# Altium schematic sheet DT_AZP1524A1_SCH1[SHEET1]_00A.SchDoc
size A3; CheckedBy: XXX; Author: DO NOT USE THIS PARAMETER; CompanyName: Azoteq (Pty) Ltd; Engineer: DO NOT USE THIS PARAMETER; SheetNumber: 1; SheetTotal: 2; Sheet_Title: Sheet 1
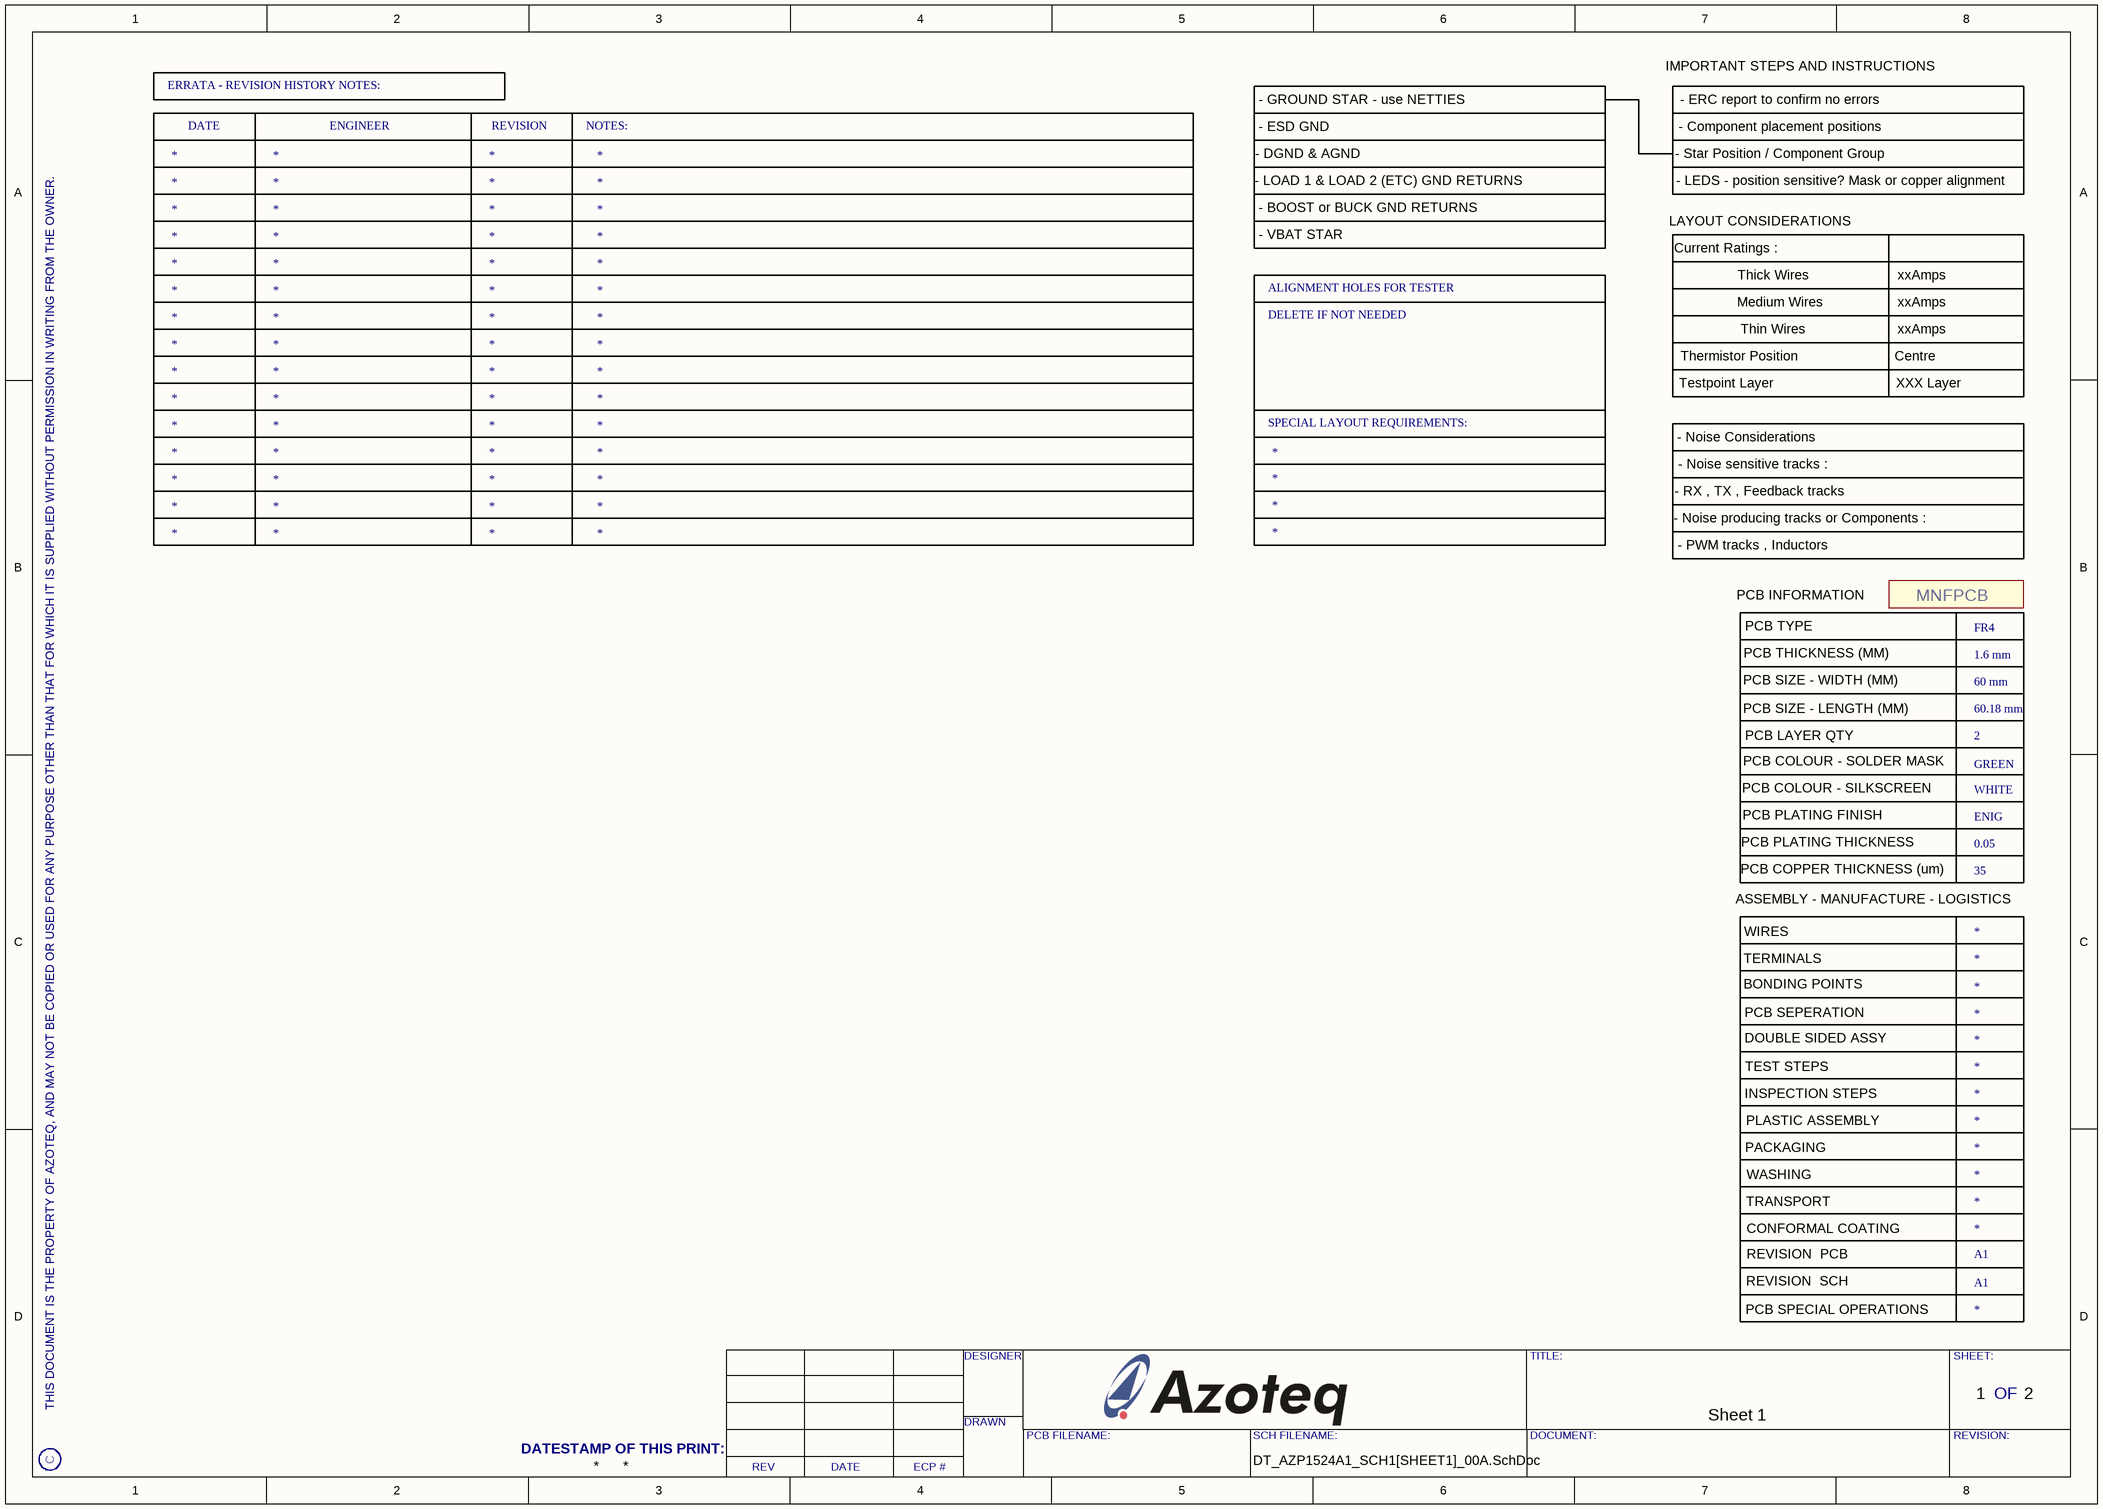
[diagram p0: DT_AZP1524A1_SCH1[SHEET1]_00A.SchDoc]

## Parts
PCB1  PCB TYPE: FR4  PCB THICKNESS: 1.6 mm  PCB LENGTH: 60.18 mm  PCB WIDTH: 60 mm  PCB COLOUR  : MASK: GREEN  PCB PLATING FINISH: ENIG  PCB LAYER QTY: 2  PCB COLOUR : SILK: WHITE  REVISION PCB: A1  Int_Part_Number: MNFPCB  PCB PLATING THICKNESS: 0.05

## Notes on the sheet
- ERRATA - REVISION HISTORY NOTES:
- - GROUND STAR - use NETTIES
- - ERC report to confirm no errors
- IMPORTANT STEPS AND INSTRUCTIONS
- *
- DATE
- ENGINEER
- REVISION
- NOTES:
- - ESD GND
- - DGND & AGND
- - LOAD 1 & LOAD 2 (ETC) GND RETURNS
- - Component placement positions
- - Star Position / Component Group
- - LEDS - position sensitive? Mask or copper alignment
- - VBAT STAR
- - BOOST or BUCK GND RETURNS
- Current Ratings :
- LAYOUT CONSIDERATIONS
- ALIGNMENT HOLES FOR TESTER
- DELETE IF NOT NEEDED
- Thick Wires
- Medium Wires
- xxAmps
- Testpoint Layer
- Thermistor Position
- Thin Wires
- Centre
- XXX Layer
- SPECIAL LAYOUT REQUIREMENTS:
- - Noise Considerations
- - Noise sensitive tracks :
- - RX , TX , Feedback tracks
- - Noise producing tracks or Components :
- - PWM tracks , Inductors
- PCB TYPE
- (near PCB1) PCB INFORMATION
- PCB THICKNESS (MM)
- PCB SIZE - WIDTH (MM)
- PCB SIZE - LENGTH (MM)
- PCB LAYER QTY
- PCB COLOUR - SILKSCREEN
- PCB COLOUR - SOLDER MASK
- PCB PLATING FINISH
- PCB PLATING THICKNESS
- PCB COPPER THICKNESS (um)
- ASSEMBLY - MANUFACTURE - LOGISTICS
- 35
- WIRES
- TERMINALS
- BONDING POINTS
- PCB SEPERATION
- DOUBLE SIDED ASSY
- TEST STEPS
- INSPECTION STEPS
- PLASTIC ASSEMBLY
- WASHING
- PACKAGING
- TRANSPORT
- REVISION  PCB
- CONFORMAL COATING
- REVISION  SCH
- PCB SPECIAL OPERATIONS
- DESIGNER
- TITLE:
- SHEET:
- OF
- THIS DOCUMENT IS THE PROPERTY OF AZOTEQ, AND MAY NOT BE COPIED OR USED FOR ANY PURPOSE OTHER THAN THAT FOR WHICH IT IS SUPPLIED WITHOUT PERMISSION IN WRITING FROM THE OWNER.
- C
- DATESTAMP OF THIS PRINT:
- REV
- ECP #
- DRAWN
- PCB FILENAME:
- SCH FILENAME:
- DOCUMENT:
- REVISION:

## Library data of the parts
PCB1 = PCB - AZCxxxA01: PCB; Generated_By: JR; Pin_Count: 1; ComponentLink1Description: Footprint Detail; ComponentLink2Description: Application Note; ComponentLink3Description: Layout Guidelines; Generated_Date: 2017-01-30; Manufacturer_PN: =Project_Document_Number; ASSY - WIRES: *; ASSY - TERMINALS: *; ASSY - BONDING POINTS: *; ASSY - PCB SEPERATION: *; ASSY - DOUBLE SIDED ASSY: *; ASSY - TEST STEPS: *; ASSY - INSPECTION STEPS: *; ASSY - PLASTIC ASSY: *; ASSY - PACKAGING: *; ASSY - TRANSPORT: *; ASSY - WASHING: *; ASSY - CONFORMAL COATING: *; REVISION SCH: A1; ASSY - PCB SPECIAL OPERATIONS: *; Alternative_SAP_Nr: *; QUOTE PART NUMBER: *